# Altium schematic sheet mcu.SchDoc: Opo4
size Letter; Author: William W. Huang; Organization: Altium Limited; Address1: L3, 12a Rodborough Rd; Address2: Frenchs Forest; Address3: NSW; Address4: Australia 2086; Revision: 1
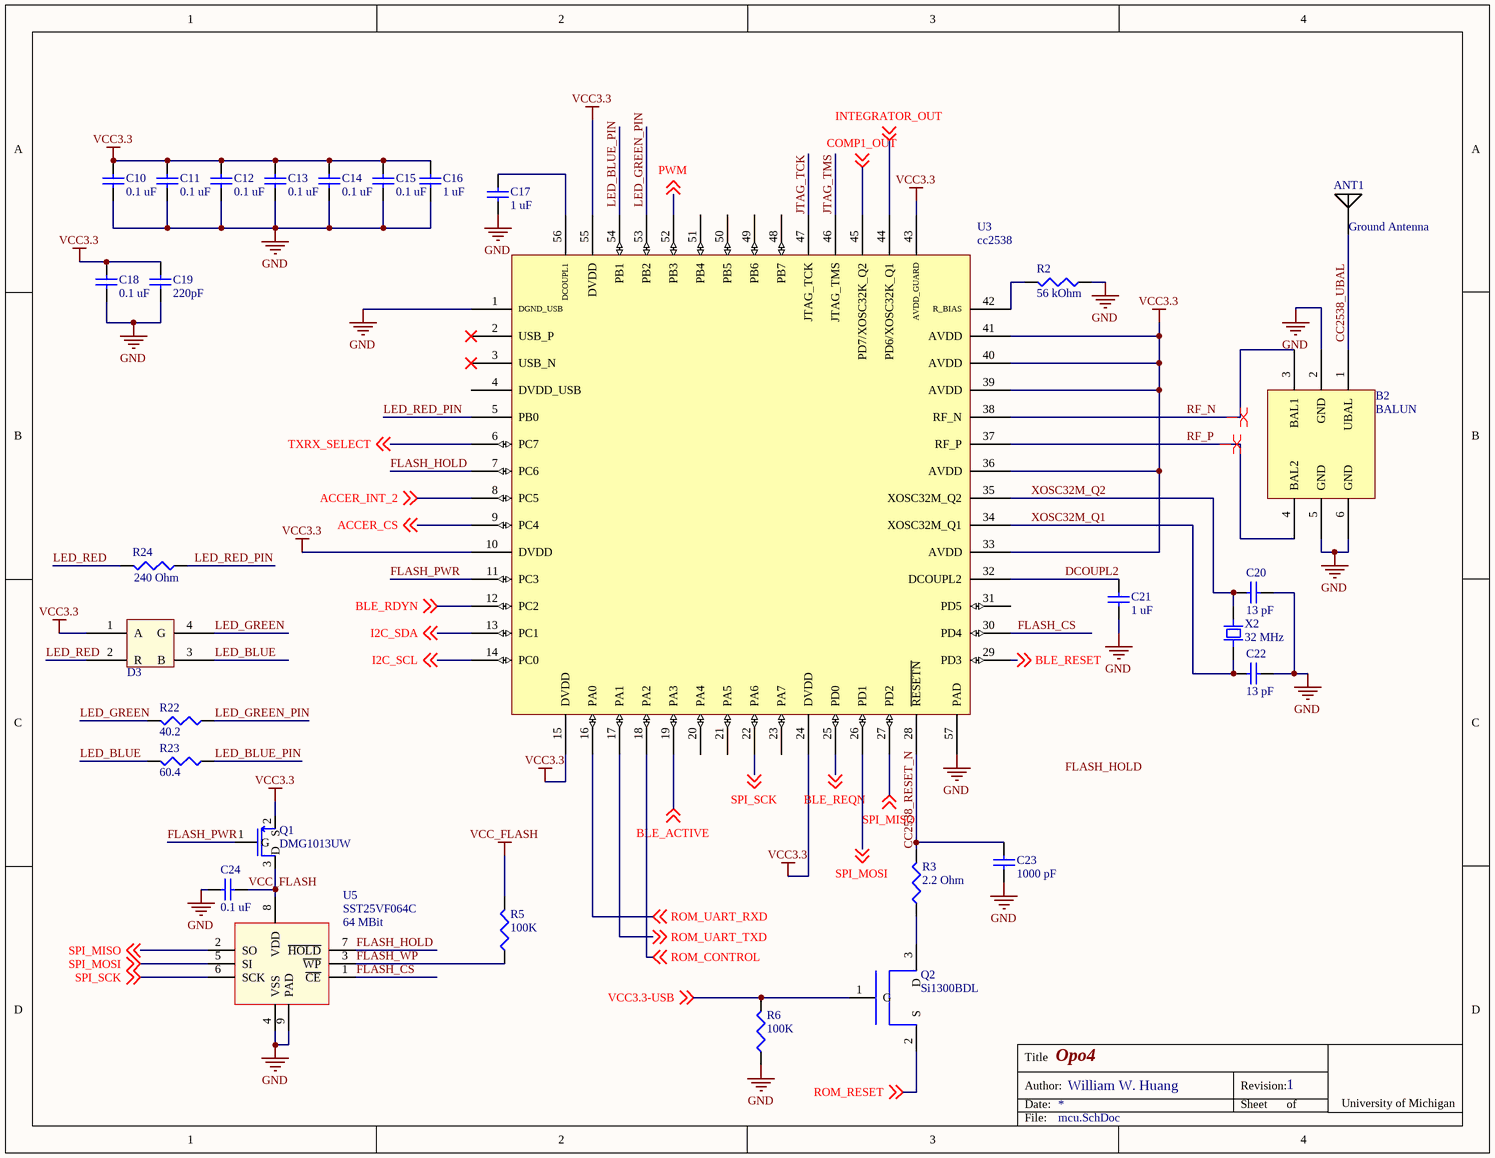
[diagram p0: mcu.SchDoc]

## Parts
ANT1  Ground Antenna  [SMD Ground Antenna]
B2  BALUN  [2450BM15A0002]
C10  value 0.1 uF  [0402]  (hidden comment: Ceramic capacitor)
C11  value 0.1 uF  [0402]  (hidden comment: Ceramic capacitor)
C12  value 0.1 uF  [0402]  (hidden comment: Ceramic capacitor)
C13  value 0.1 uF  [0402]  (hidden comment: Ceramic capacitor)
C14  value 0.1 uF  [0402]  (hidden comment: Ceramic capacitor)
C15  value 0.1 uF  [0402]  (hidden comment: Ceramic capacitor)
C16  value 1 uF  [0402]  (hidden comment: Ceramic capacitor)
C17  value 1 uF  [0402]  (hidden comment: Ceramic capacitor)
C18  value 0.1 uF  [0402]  (hidden comment: Ceramic capacitor)
C19  value 220pF  [0402]  (hidden comment: 220pF 0402 ceramic cap)
C20  value 13 pF  [0402]  (hidden comment: 13pf 0402 Cap)
C21  value 1 uF  [0402]  (hidden comment: Ceramic capacitor)
C22  value 13 pF  [0402]  (hidden comment: 13pf 0402 Cap)
C23  value 1000 pF  [0402]  (hidden comment: Ceramic capacitor)
C24  value 0.1 uF  [0402]  (hidden comment: Ceramic capacitor)
D3  Tri Color LED  [0404]  (value not drawn)
Q1  DMG1013UW  [SC70-3]
Q2  Si1300BDL  [SC70-3]
R2  value 56 kOhm  [0402]  (hidden comment: 56k 0402 Res)
R3  value 2.2 Ohm  [0402]  (hidden comment: 2.2 Ohm 0402 Res)
R5  value 100K  [0402]  (hidden comment: Chip resistor)
R6  value 100K  [0402]  (hidden comment: Chip resistor)
R22  value 40.2  [0201]  (hidden comment: Chip Resistor)
R23  value 60.4  [0201]  (hidden comment: Chip resistor)
R24  value 240 Ohm  [0201]  (hidden comment: Chip resistor)
U3  cc2538  [QFN50P800X800X100_HS-57N]
U5  SST25VF064C  Capacity: 64 MBit  [WSON]
X2  value 32 MHz  [FA-128]  (hidden comment: 32 MHz Crystal)

## Nets
GND: B2.2(GND) B2.5(GND) B2.6(GND) C10.2 C11.2 C12.2 C13.2 C14.2 C15.2 C16.2 C17.2 C18.2 C19.2 C20.2 C21.2 C22.1 C23.2 C24.1 R2.2 R6.2 U3.1(DGND_USB) U3.57(PAD) U5.4(VSS) U5.9(PAD)
VCC3.3: C10.1 C11.1 C12.1 C13.1 C14.1 C15.1 C16.1 C18.1 C19.1 D3.1(A) Q1.2(S) U3.10(DVDD) U3.15(DVDD) U3.24(DVDD) U3.33(AVDD) U3.36(AVDD) U3.39(AVDD) U3.40(AVDD) U3.41(AVDD) U3.43(AVDD_GUARD) U3.55(DVDD)
VCC_FLASH: C24.2 Q1.3(D) R5.1 U5.8(VDD)
ACCER_CS: U3.9(PC4) ; off-sheet ACCER_CS
ACCER_INT_2: U3.8(PC5) ; off-sheet ACCER_INT_2
BLE_ACTIVE: U3.19(PA3) ; off-sheet BLE_ACTIVE
BLE_RDYN: U3.12(PC2) ; off-sheet BLE_RDYN
BLE_REQN: U3.25(PD0) ; off-sheet BLE_REQN
BLE_RESET: U3.29(PD3) ; off-sheet BLE_RESET
CC2538_RESET_N: C23.1 R3.1 U3.28(~{RESETN})
CC2538_UBAL: ANT1.1 B2.1(UBAL)
COMP1_OUT: U3.45(PD7/XOSC32K_Q2) ; off-sheet COMP1_OUT
DCOUPL2: C21.1 U3.32(DCOUPL2)
FLASH_CS: U3.30(PD4) U5.1(~{CE})
FLASH_HOLD: U3.7(PC6) U5.7(~{HOLD})
FLASH_PWR: Q1.1(G) U3.11(PC3)
FLASH_WP: R5.2 U5.3(~{WP})
I2C_SCL: U3.14(PC0) ; off-sheet I2C_SCL
I2C_SDA: U3.13(PC1) ; off-sheet I2C_SDA
INTEGRATOR_OUT: U3.44(PD6/XOSC32K_Q1) ; off-sheet INTEGRATOR_OUT
JTAG_TCK: U3.47(JTAG_TCK)
JTAG_TMS: U3.46(JTAG_TMS)
LED_BLUE: D3.3(B) R23.1
LED_BLUE_PIN: R23.2 U3.54(PB1)
LED_GREEN: D3.4(G) R22.1
LED_GREEN_PIN: R22.2 U3.53(PB2)
LED_RED: D3.2(R) R24.1
LED_RED_PIN: R24.2 U3.5(PB0)
PWM: U3.52(PB3) ; off-sheet PWM
RF_N: B2.3(BAL1) U3.38(RF_N)
RF_P: B2.4(BAL2) U3.37(RF_P)
ROM_CONTROL: U3.18(PA2) ; off-sheet ROM_CONTROL
ROM_RESET: Q2.2(S) ; off-sheet ROM_RESET
ROM_UART_RXD: U3.16(PA0) ; off-sheet ROM_UART_RXD
ROM_UART_TXD: U3.17(PA1) ; off-sheet ROM_UART_TXD
SPI_MISO: U3.27(PD2) U5.2(SO) ; off-sheet SPI_MISO
SPI_MOSI: U3.26(PD1) U5.5(SI) ; off-sheet SPI_MOSI
SPI_SCK: U3.22(PA6) U5.6(SCK) ; off-sheet SPI_SCK
TXRX_SELECT: U3.6(PC7) ; off-sheet TXRX_SELECT
VCC3.3-USB: Q2.1(G) R6.1 ; off-sheet VCC3.3-USB
XOSC32M_Q1: C22.2 U3.34(XOSC32M_Q1) X2.3
XOSC32M_Q2: C20.1 U3.35(XOSC32M_Q2) X2.1
NetC17_1: C17.1 U3.56(DCOUPL1)
NetQ2_3: Q2.3(D) R3.2
NetR2_1: R2.1 U3.42(R_BIAS)

Not connected (* = marked no-connect by the designer): U3 2(USB_P)* 3(USB_N)* 4(DVDD_USB) 20(PA4) 21(PA5) 23(PA7) 31(PD5) 48(PB7) 49(PB6) 50(PB5) 51(PB4)

## Layout directives
differential pair: RF_N, RF_P

## Notes on the sheet
- Labels drawn without touching a wire or pin: FLASH_HOLD
- Title
- Date:
- Author:
- Revision:
- Sheet
- of
- University of Michigan
- File:

## Library data of the parts
ANT1 = Molex Antenna: Molex 2.4 GHz SMD On-Ground Antenna; Supplier 1: Digikey; Supplier Part Number 1: WM4893CT-ND
B2 = cc2538_Balun: Johanson CC253X Balun; Mfr: Johanson Technology; Supplier 1: Digikey; Supplier Part Number 1: 712-1536-1-ND; Mfr Part Number: 2450BM15A0002
C10-C15 C18 C24 = C_0.1u_0402_ceramic: Ceramic capacitor, 0.1u, 0402 package; Manufacture: TDK; voltage rated: 10 V; tolerance: 10%; Supplier 1: Digi-Key; Supplier Part Number 1: 445-1265-1-ND; package: 0402
C16 C17 C21 = C_1u_0402_ceramic: Ceramic capacitor, 1 uF, 0402 package; Manufacture: TDK; voltage rated: 6.3 V; tolerance: 10%; package: 0402; Supplier 1: Digi-Key; Supplier Part Number 1: 445-5000-1-ND
C19 = C_220pf_0402_ceramic: 220pF 5% 50 V C0G NP0 0402 ceramic cap; Mfr: Murata; Mfr Part Number: GRM1555C1H221JA01D; Supplier 1: Digikey; Supplier Part Number 1: 490-1293-1-ND
C20 C22 = C_13p_0402: 13pf, 50V, 2%, c0G, NP0, 0402, ceramic; Mfr: Murata; Mfr Part Number: GRM1555C1H130GA01D; Supplier 1: Digikey; Supplier Part Number 1: 490-8184-1-ND
C23 = C_1000p_0402_ceramic: Ceramic capacitor, 1000 pF, 0402 package; Manufacture: TDK; voltage rated: 50 V; tolerance: 10%; package: 0402; Supplier 1: Digi-Key; Supplier Part Number 1: 445-6846-1-ND
D3 = D_LED_RGB_0404: LED, RGB, 0404; Supplier 1: Digikey; Supplier Part Number 1: SMLP34RGB2W3CT-ND
Q1 = DMG1013UW: P-CHANNEL ENHANCEMENT MODE MOSFET; Supplier 1: Digi-Key; Supplier Part Number 1: DMG1013UW-7DICT-ND
Q2 = Si1300BDL: MOSFET N-CH D-S 20V SC-70-3; Supplier 1: Digi-Key; Supplier Part Number 1: SI1300BDL-T1-GE3CT-ND
R2 = R_56K_0402: 56 kOhm, 1%, .0603 W, 0402; Mfr: Rohm; Mfr Part Number: MCR01MRTF5602; Supplier 1: Digikey; Supplier Part Number 1: RHM56.0KCDCT-ND
R3 = R_2.2_0402: 2.2 Ohm, 1%, .063W, 0402; Mfr: Vishay Dale; Mfr Part Number: CRCW04022R20FKED; Supplier 1: Digikey; Supplier Part Number 1: 541-2.20LLCT-ND
R5 R6 = R_100K_0402: Chip resistor, 100K, 0402 package; tolerance: 1%; power: 1/16 W; Supplier 1: Digi-Key; Supplier Part Number 1: 541-100KLCT-ND; package: 0402
R22 = R_40.2_0201: 40.2 Ohm 0201 1% Chip Resistor; Supplier 1: Digikey; Supplier Part Number 1: 1276-3586-1-ND
R23 = R_60.4_0201: 60.4 Ohm, .05W, 1% 0201 Chip Resistor; Supplier 1: DIgikey; Supplier Part Number 1: P60.4ABCT-ND
R24 = R_240_0201: 240 Ohm, 1%, .05W, 0201 Chip Resistor; Supplier 1: Digikey; Supplier Part Number 1: P240AGCT-ND
U3 = cc2538: cc2538 MCU/802.15.4 radio; Supplier 1: Digikey; Supplier Part Number 1: 296-35797-1-ND
U5 = SST25VF064C: 64 Mbit SPI Serial Dual I/O Flash; Supplier 1: Digi-Key; Supplier Part Number 1: SST25VF064C-80-4I-Q2AE-CT-ND
X2 = X_32M_FA-128: 32MHz, 10ppm, 10pF, 60 Ohm; Mfr: Epson; Mfr Part Number: FA-128 32.0000MF20X-K3; Supplier 1: Digikey; Supplier Part Number 1: SER3800CT-ND